# EAGLE schematic OSDK_USB-C-3 (EAGLE 9.6.2)
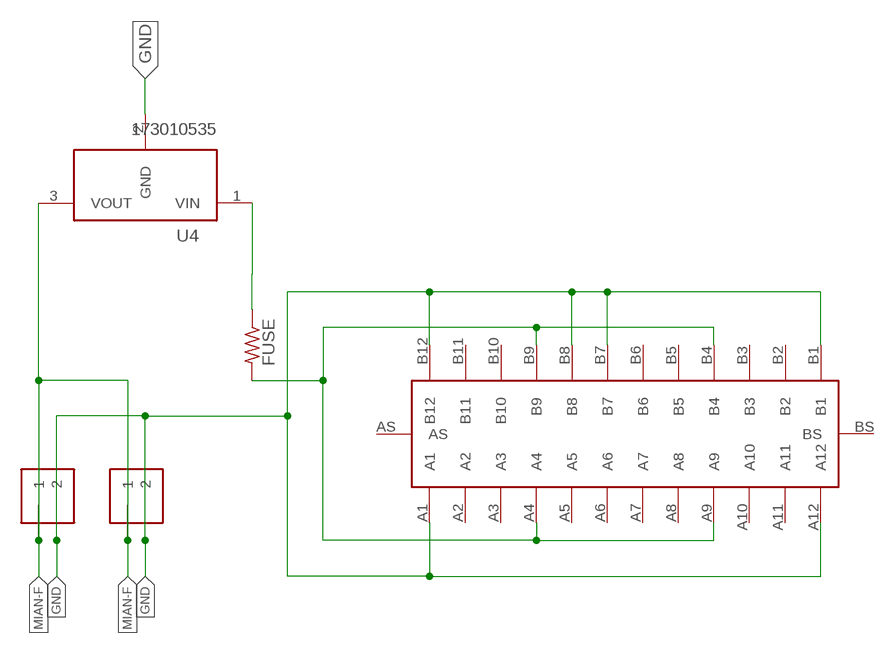
[diagram p0: schematic, sheet 1]

## Parts
CU3124PAAHLA002-NH  USB-C  [USB-C]
FUSE  R-US_0207/9  [0207/9]
J1  ADAFRUIT_1X2-3.5MM  [ADAFRUIT_1X2-3.5MM]
J2  ADAFRUIT_1X2-3.5MM  [ADAFRUIT_1X2-3.5MM]
U4  173010535  [173010535]

## Nets
GND: CU3124PAAHLA002-NH.A1 CU3124PAAHLA002-NH.A12 CU3124PAAHLA002-NH.B1 CU3124PAAHLA002-NH.B7 CU3124PAAHLA002-NH.B8 CU3124PAAHLA002-NH.B12 J1.2 J2.2 U4.2(GND)
MAIN: CU3124PAAHLA002-NH.A4 CU3124PAAHLA002-NH.A9 CU3124PAAHLA002-NH.B4 CU3124PAAHLA002-NH.B9 FUSE.2
MIAN-F: J1.1 J2.1 U4.3(VOUT)
VIN: FUSE.1 U4.1(VIN)
Unconnected: CU3124PAAHLA002-NH.A2 CU3124PAAHLA002-NH.A3 CU3124PAAHLA002-NH.A5 CU3124PAAHLA002-NH.A6 CU3124PAAHLA002-NH.A7 CU3124PAAHLA002-NH.A8 CU3124PAAHLA002-NH.A10 CU3124PAAHLA002-NH.A11 CU3124PAAHLA002-NH.AS CU3124PAAHLA002-NH.B2 CU3124PAAHLA002-NH.B3 CU3124PAAHLA002-NH.B5 CU3124PAAHLA002-NH.B6 CU3124PAAHLA002-NH.B10 CU3124PAAHLA002-NH.B11 CU3124PAAHLA002-NH.BS

## Library data of the parts
CU3124PAAHLA002-NH = OSDK_USB-C-2:USB-C
FUSE = adafruit:R-US_: RESISTOR, American symbol
J1 J2 = DCDC-Relay:ADAFRUIT_1X2: 3.5mm Terminal block http://www.ladyada.net/library/pcb/eaglelibrary.html
U4 = DC-DC Converter:173010535: FDSM FIXED STEP DOWN REGULATOR M Manufacturer's datasheet <https://www.we-online.com/catalog/datasheet/173010335.pdf>; CREATED_BY: PCBLayout.com; DIGIKEY_PARTNO: 732-173010535-ND; MANUFACTURER: Würth Elektronik; MPN: 173010535